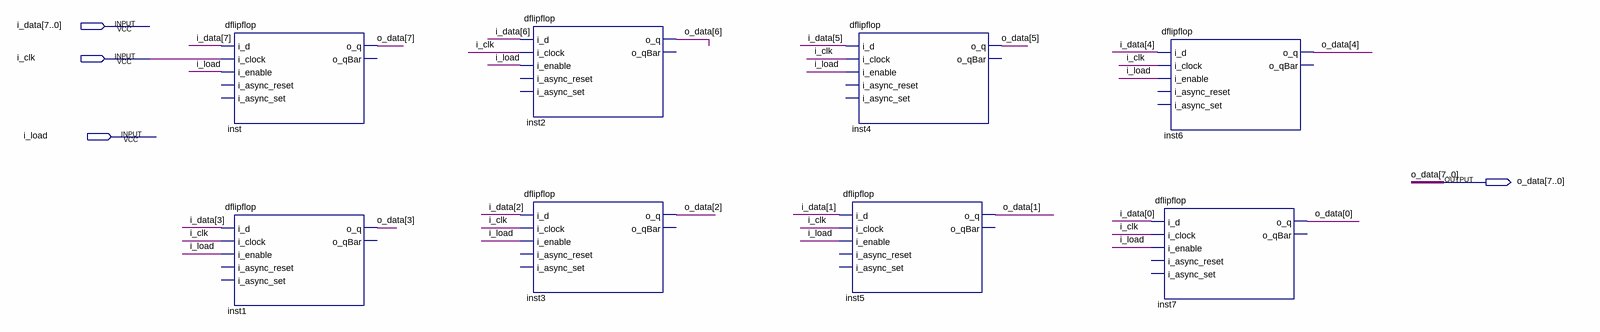
[diagram p0: schematic sheet]
// Quartus schematic Register8bit.bdf as structural Verilog: 8 symbols, 4 pins
module Register8bit (
  input  [7:0] i_data,
  input  i_clk,
  input  i_load,
  output [7:0] o_data
);

  dflipflop inst (
    .i_d(i_data[7]), .i_clock(i_clk), .i_enable(i_load), .o_q(o_data[7]));  // open: i_async_reset, i_async_set, o_qBar
  dflipflop inst1 (
    .i_d(i_data[3]), .i_clock(i_clk), .i_enable(i_load), .o_q(o_data[3]));  // open: i_async_reset, i_async_set, o_qBar
  dflipflop inst2 (
    .i_d(i_data[6]), .i_clock(i_clk), .i_enable(i_load), .o_q(o_data[6]));  // open: i_async_reset, i_async_set, o_qBar
  dflipflop inst3 (
    .i_d(i_data[2]), .i_clock(i_clk), .i_enable(i_load), .o_q(o_data[2]));  // open: i_async_reset, i_async_set, o_qBar
  dflipflop inst4 (
    .i_d(i_data[5]), .i_clock(i_clk), .i_enable(i_load), .o_q(o_data[5]));  // open: i_async_reset, i_async_set, o_qBar
  dflipflop inst5 (
    .i_d(i_data[1]), .i_clock(i_clk), .i_enable(i_load), .o_q(o_data[1]));  // open: i_async_reset, i_async_set, o_qBar
  dflipflop inst6 (
    .i_d(i_data[4]), .i_clock(i_clk), .i_enable(i_load), .o_q(o_data[4]));  // open: i_async_reset, i_async_set, o_qBar
  dflipflop inst7 (
    .i_d(i_data[0]), .i_clock(i_clk), .i_enable(i_load), .o_q(o_data[0]));  // open: i_async_reset, i_async_set, o_qBar
endmodule
